# EAGLE schematic AlarmSystem (EAGLE 9.6.2)
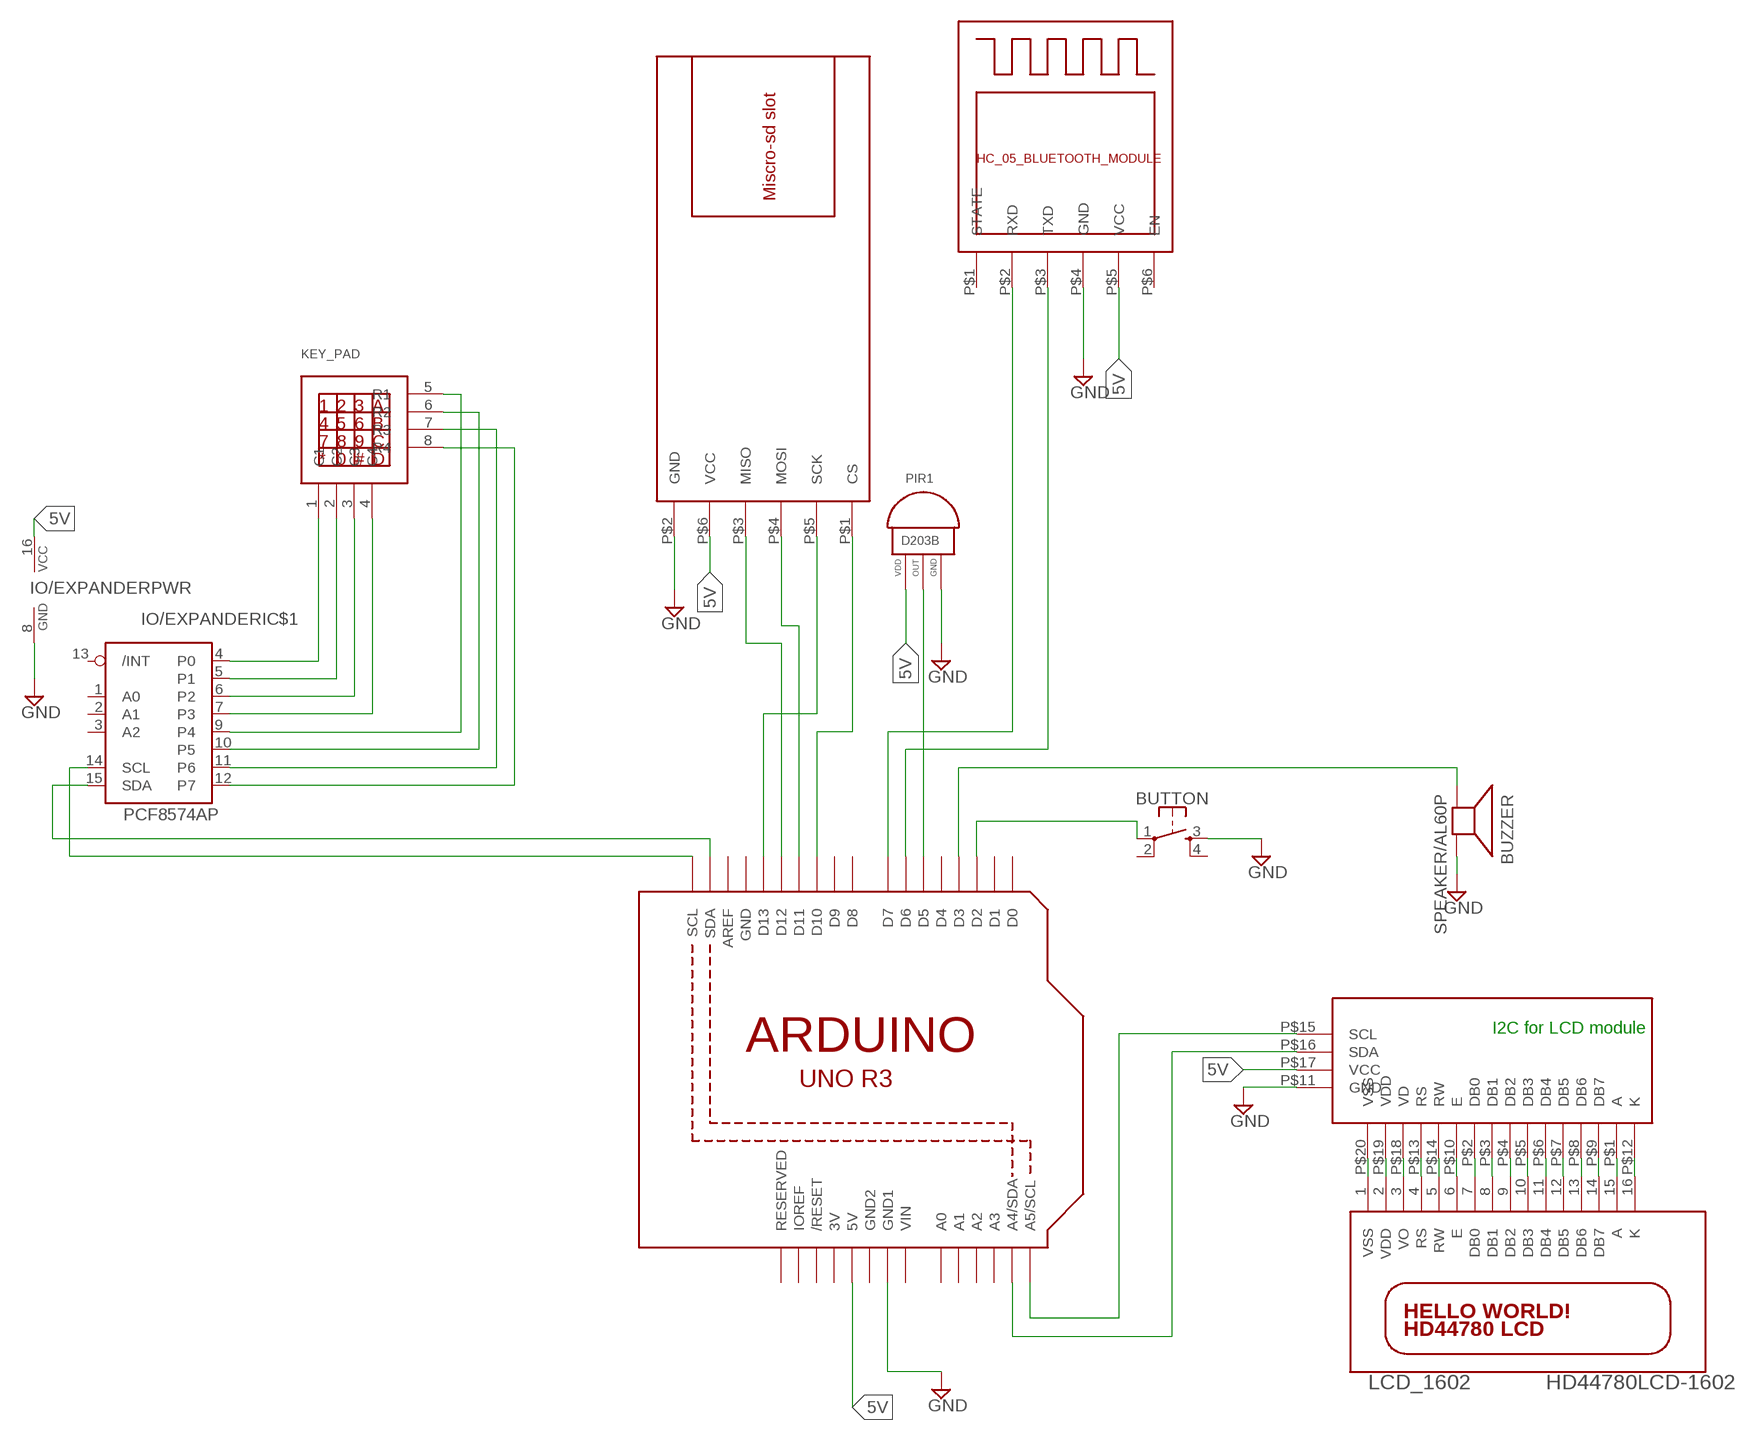
[diagram p0: schematic, sheet 1]

## Parts
BUTTON  SPARKFUN-SWITCHES_MOMENTARY-SWITCH-SPST-2-SMD-4.6X2.8MM  [SPARKFUN-SWITCHES_TACTILE_SWITCH_SMD_4.6X2.8MM]
BUZZER  SPEAKER/AL60P  [AL60P]
HC-05_BLUETOOTH_MODULE  HC_05_BLUETOOTH_MODULE  [HC_05_BLUETOOTH_MODULE]
I2C_LCD  I2C_LCD  [I2C_LCD]
IO/EXPANDER  PCF8574AP  [DIL16]
KEY_PAD  KEYPAD4X4  [KEYPAD4X4]
LCD_1602  HD44780LCD-1602  [LCD1602]
MICRO_SD_MODULE  SD_CARD_MODULE  [MICRO_SD_MODULE]
PIR1  D203B  [3PIN]
U1  ARDUINOR3-DIMENSION  [ARDUINOR3]

## Nets
5V: HC-05_BLUETOOTH_MODULE.P$5(VCC) I2C_LCD.P$17(VCC) IO/EXPANDER.16(PWR:VCC) MICRO_SD_MODULE.P$6(VCC) PIR1.1(VDD) U1.5V
GND: BUTTON.3 BUZZER.2(-) HC-05_BLUETOOTH_MODULE.P$4(GND) I2C_LCD.P$11(GND) IO/EXPANDER.8(PWR:GND) MICRO_SD_MODULE.P$2(GND) PIR1.3(GND) U1.GND1
N$1: BUTTON.1 U1.D2
N$2: PIR1.2(OUT) U1.D5
N$3: BUZZER.1(+) U1.D3
N$4: IO/EXPANDER.4(IC$1:P0) KEY_PAD.1(C1)
N$5: IO/EXPANDER.5(IC$1:P1) KEY_PAD.2(C2)
N$6: MICRO_SD_MODULE.P$5(SCK) U1.D13
N$7: MICRO_SD_MODULE.P$1(CS) U1.D10
N$8: MICRO_SD_MODULE.P$3(MISO) U1.D12
N$9: MICRO_SD_MODULE.P$4(MOSI) U1.D11
N$10: IO/EXPANDER.6(IC$1:P2) KEY_PAD.3(C3)
N$11: IO/EXPANDER.7(IC$1:P3) KEY_PAD.4(C4)
N$12: IO/EXPANDER.9(IC$1:P4) KEY_PAD.5(R1)
N$13: IO/EXPANDER.14(IC$1:SCL) U1.SCL
N$14: IO/EXPANDER.10(IC$1:P5) KEY_PAD.6(R2)
N$15: IO/EXPANDER.11(IC$1:P6) KEY_PAD.7(R3)
N$16: IO/EXPANDER.12(IC$1:P7) KEY_PAD.8(R4)
N$17: IO/EXPANDER.15(IC$1:SDA) U1.SDA
N$18: HC-05_BLUETOOTH_MODULE.P$2(RXD) U1.D7
N$19: HC-05_BLUETOOTH_MODULE.P$3(TXD) U1.D6
N$21: I2C_LCD.P$12(K) LCD_1602.16(K)
N$22: I2C_LCD.P$1(A) LCD_1602.15(A)
N$23: I2C_LCD.P$9(DB7) LCD_1602.14(DB7)
N$24: I2C_LCD.P$8(DB6) LCD_1602.13(DB6)
N$25: I2C_LCD.P$7(DB5) LCD_1602.12(DB5)
N$26: I2C_LCD.P$6(DB4) LCD_1602.11(DB4)
N$27: I2C_LCD.P$5(DB3) LCD_1602.10(DB3)
N$28: I2C_LCD.P$4(DB2) LCD_1602.9(DB2)
N$29: I2C_LCD.P$3(DB1) LCD_1602.8(DB1)
N$30: I2C_LCD.P$2(DB0) LCD_1602.7(DB0)
N$31: I2C_LCD.P$10(E) LCD_1602.6(E)
N$32: I2C_LCD.P$14(RW) LCD_1602.5(RW)
N$33: I2C_LCD.P$13(RS) LCD_1602.4(RS)
N$34: I2C_LCD.P$18(VD) LCD_1602.3(VO)
N$39: I2C_LCD.P$15(SCL) U1.A5(A5/SCL)
N$40: I2C_LCD.P$16(SDA) U1.A4(A4/SDA)
VDD: I2C_LCD.P$19(VDD) LCD_1602.2(VDD)
VSS: I2C_LCD.P$20(VSS) LCD_1602.1(VSS)
Unconnected: BUTTON.2 BUTTON.4 HC-05_BLUETOOTH_MODULE.P$1(STATE) HC-05_BLUETOOTH_MODULE.P$6(EN) IO/EXPANDER.1(IC$1:A0) IO/EXPANDER.2(IC$1:A1) IO/EXPANDER.3(IC$1:A2) IO/EXPANDER.13(IC$1:/INT) U1.A0 U1.A1 U1.A2 U1.A3 U1.AREF U1.D0 U1.D1 U1.D4 U1.D8 U1.D9 U1.IOREF U1.RESERVED U1.RESET(/RESET)

## Notes on the sheet
- I2C for LCD module

## Power pins joined to a net without a drawn wire
3V: U1.3V
GND: U1.GND
GND2: U1.GND2
VIN: U1.VIN

## Library data of the parts
BUTTON = ESP32_WROVER:SPARKFUN-SWITCHES_MOMENTARY-SWITCH-SPST-2: Momentary Switch (Pushbutton) - SPST - Two Circuits Normally-open (NO) SPST momentary switches (buttons, pushbuttons). Schematic symbol includes two switch circuits. Variants SMD-4.6MMX2.8MM - 4.60mm x 2.80mm Tactile Momentary Button Switch - Used on SparkFun SAMD21 Mini Breakout <https://www.sparkfun.com/products/13664> SMD-5.2MM - Mini Pushbutton Switch - SMD <https://www.sparkfun.com/products/8720> - Used on Arduino Pro Mini <https://www.sparkfun.com/products/11114>; PROD_ID: SWCH-14139; SF_SKU: COM-08720
BUZZER = adafruit:SPEAKER: SPEAKER Source: Buerklin Added PS12 (for part # PS1240 piezo) http://www.ladyada.net/library/pcb/eaglelibrary.html
HC-05_BLUETOOTH_MODULE = Lab2:HC_05_BLUETOOTH_MODULE
I2C_LCD = Lab2:I2C_LCD
IO/EXPANDER = i2c:PCF8574: Remote 8-Bit I/O Expander for I²C Bus
KEY_PAD = keypad_4x4_raw:KEYPAD4X4
LCD_1602 = adafruit:HD44780LCD: HD44780 LCD Standard character type LCDs, available in sizes from 8x1 to 40x4!
MICRO_SD_MODULE = Lab2:SD_CARD_MODULE
PIR1 = senba-pir-sensor:D203B
U1 = adafruit:ARDUINOR3: This is a new object for the new Arduino R3 - with extra pins that you may want to use (such as IOref, and duplicated A4/A5